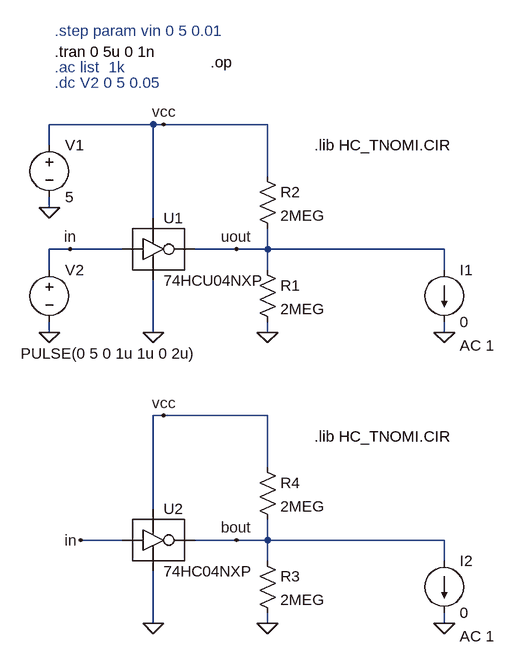
[diagram p0: schematic 74hcu04gate2.asc]
74hcu04gate2.asc, the LTspice schematic file:
Version 4
SHEET 1 2012 1696
WIRE 656 176 496 176
WIRE 672 176 656 176
WIRE 832 176 672 176
WIRE 496 208 496 176
WIRE 832 256 832 176
WIRE 496 304 496 288
WIRE 656 320 656 176
WIRE 528 368 496 368
WIRE 608 368 528 368
WIRE 784 368 720 368
WIRE 832 368 832 336
WIRE 832 368 784 368
WIRE 1104 368 832 368
WIRE 496 400 496 368
WIRE 832 400 832 368
WIRE 1104 400 1104 368
WIRE 496 496 496 480
WIRE 656 496 656 416
WIRE 832 496 832 480
WIRE 1104 496 1104 480
WIRE 672 624 656 624
WIRE 832 624 672 624
WIRE 832 704 832 624
WIRE 656 768 656 624
WIRE 608 816 544 816
WIRE 784 816 720 816
WIRE 832 816 832 784
WIRE 832 816 784 816
WIRE 1104 816 832 816
WIRE 832 848 832 816
WIRE 1104 848 1104 816
WIRE 656 944 656 864
WIRE 832 944 832 928
WIRE 1104 944 1104 928
FLAG 496 304 0
FLAG 496 496 0
FLAG 832 496 0
FLAG 672 176 vcc
FLAG 528 368 in
FLAG 784 368 uout
FLAG 656 496 0
FLAG 1104 496 0
FLAG 832 944 0
FLAG 672 624 vcc
FLAG 784 816 bout
FLAG 656 944 0
FLAG 1104 944 0
FLAG 544 816 in
SYMBOL voltage 496 192 R0
SYMATTR InstName V1
SYMATTR Value 5
SYMBOL voltage 496 384 R0
WINDOW 123 0 0 Left 0
WINDOW 39 0 0 Left 0
WINDOW 3 -44 145 Left 0
SYMATTR InstName V2
SYMATTR Value PULSE(0 5 0 1u 1u 0 2u)
SYMBOL res 816 384 R0
SYMATTR InstName R1
SYMATTR Value 2MEG
SYMBOL res 816 240 R0
SYMATTR InstName R2
SYMATTR Value 2MEG
SYMBOL current 1104 400 R0
WINDOW 123 24 116 Left 0
WINDOW 39 0 0 Left 0
SYMATTR Value2 AC 1
SYMATTR InstName I1
SYMATTR Value 0
SYMBOL res 816 832 R0
SYMATTR InstName R3
SYMATTR Value 2MEG
SYMBOL res 816 688 R0
SYMATTR InstName R4
SYMATTR Value 2MEG
SYMBOL current 1104 848 R0
WINDOW 123 24 116 Left 0
WINDOW 39 0 0 Left 0
SYMATTR Value2 AC 1
SYMATTR InstName I2
SYMATTR Value 0
SYMBOL 74hcu04nxp 656 304 R0
SYMATTR InstName U1
SYMBOL 74hc04nxp 656 752 R0
SYMATTR InstName U2
TEXT 504 112 Left 0 ;.dc V2 0 5 0.05
TEXT 904 208 Left 0 !.lib HC_TNOMI.CIR
TEXT 744 80 Left 0 !.op
TEXT 504 32 Left 0 ;.step param vin 0 5 0.01
TEXT 504 88 Left 0 ;.ac list  1k
TEXT 504 64 Left 0 !.tran 0 5u 0 1n
TEXT 904 656 Left 0 !.lib HC_TNOMI.CIR

The netlist it stands for:
* 74hcu04gate2.asc
V1 vcc 0 5
V2 in 0 PULSE(0 5 0 1u 1u 0 2u)
R1 uout 0 2MEG
R2 vcc uout 2MEG
I1 uout 0 0 AC 1
R3 bout 0 2MEG
R4 vcc bout 2MEG
I2 bout 0 0 AC 1
XU1 in uout vcc 0 74HCU04NXP inv0  ; pins A Y VCC VSS
XU2 in bout vcc 0 74HC04NXP inv2  ; pins A Y VCC VSS
* .dc V2 0 5 0.05
.lib HC_TNOMI.CIR
.op
* .step param vin 0 5 0.01
* .ac list  1k
.tran 0 5u 0 1n
.lib HC_TNOMI.CIR
.backanno
.end